# EAGLE design p2mini-001 (EAGLE 7.1.0)
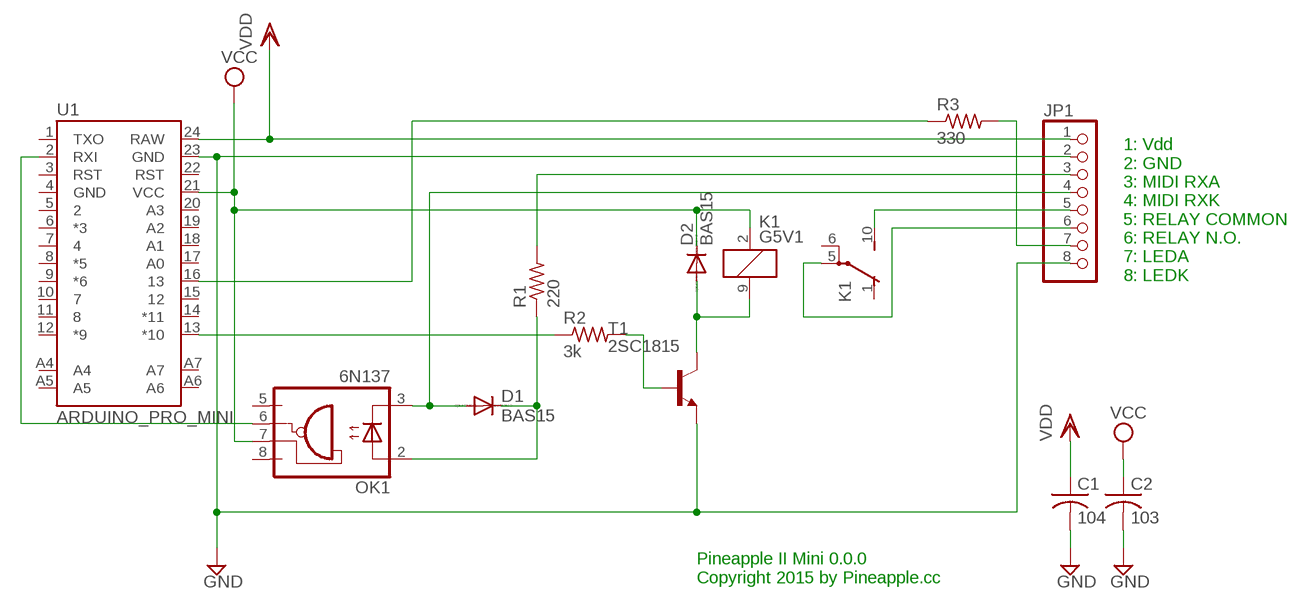
[diagram p0: schematic, sheet 1]

## Parts
C1  104  C-US025-025X050  [C025-025X050]
C2  103  C-US025-025X050  [C025-025X050]
D1  BAS15  [DO34-7]
D2  BAS15  [DO34-7]
JP1  PINHD-1X8  [1X08]
K1  G5V1  [G5V1]
OK1  6N137  [DIL08]
R1  220  R-US_0204/5  [0204/5]
R2  3k  R-US_0204/5  [0204/5]
R3  330  R-US_0204/5  [0204/5]
T1  2SC1815  [TO92-ECB]
U1  ARDUINO_PRO_MINI  [ARDUINO_PRO_MINI]

## Nets
GND: C1.2 C2.2 JP1.2 JP1.8 T1.E U1.23(GND)
MIDI0: JP1.3 R1.2
MIDI1: D1.A JP1.4 OK1.3(C)
N$1: JP1.5 K1.10(2:S)
N$2: D2.A K1.9 T1.C
N$3: R2.1 U1.13(*10)
N$4: R2.2 T1.B
N$5: JP1.6 K1.5(2:P)
N$6: R3.1 U1.16
N$8: JP1.7 R3.2
N$13: D1.C OK1.2(A) R1.1
RX: OK1.6(VO) U1.2(RXI)
VCC: C2.1 D2.C K1.2 OK1.7(VE) U1.21(VCC)
VDD: C1.1 JP1.1 U1.24(RAW)
Unconnected: K1.1(2:O) K1.6(2:P) OK1.5(GND) OK1.8(VCC) U1.1(TXO) U1.3(RST) U1.4(GND) U1.5 U1.6(*3) U1.7 U1.8(*5) U1.9(*6) U1.10 U1.11 U1.12(*9) U1.14(*11) U1.15 U1.17(A0) U1.18(A1) U1.19(A2) U1.20(A3) U1.22(RST) U1.A4 U1.A5 U1.A6 U1.A7

## Notes on the sheet
- 1: Vdd
  2: GND
  3: MIDI RXA
  4: MIDI RXK
  5: RELAY COMMON
  6: RELAY N.O.
  7: LEDA
  8: LEDK
- Pineapple II Mini 0.0.0
  Copyright 2015 by Pineapple.cc

## Library data of the parts
C1 C2 = rcl:C-US: CAPACITOR, American symbol
D1 D2 = diode:BAS15: DIODE high speed
JP1 = pinhead:PINHD-1X8: PIN HEADER
K1 = relay:G5V1: RELAY 1 x switch, 0.5 A/125 V AC, 1 A/24 V DC , Omron; MPN: G5V-1-DC24; OC_FARNELL: 9949593; OC_NEWARK: 36M6377
OK1 = optocoupler:6N137: MOTOROLA OPTO COUPLER; MPN: 6N137; OC_FARNELL: 1328376; OC_NEWARK: 52M1895
R1-R3 = resistor:R-US_: RESISTOR, American symbol
T1 = transistor:2SC1815: NPN EPITAXIAL TRANSISTOR Source: TOSHIBA .. 2SC1815 1.pdf
U1 = SparkFun-Boards:ARDUINO_PRO_MINI

## Board
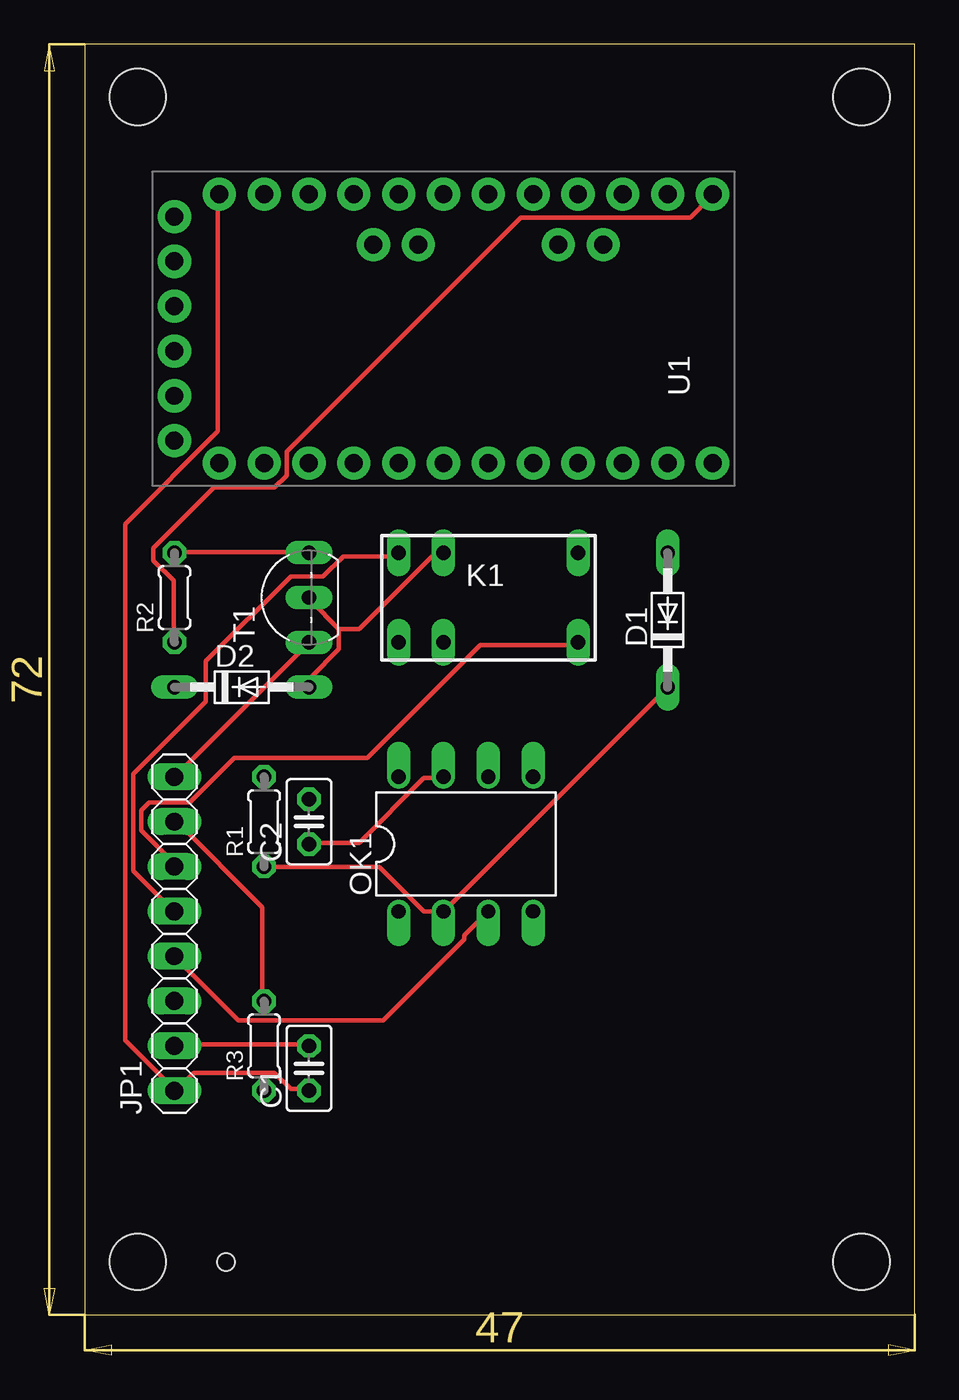
[diagram p1: board, top side]
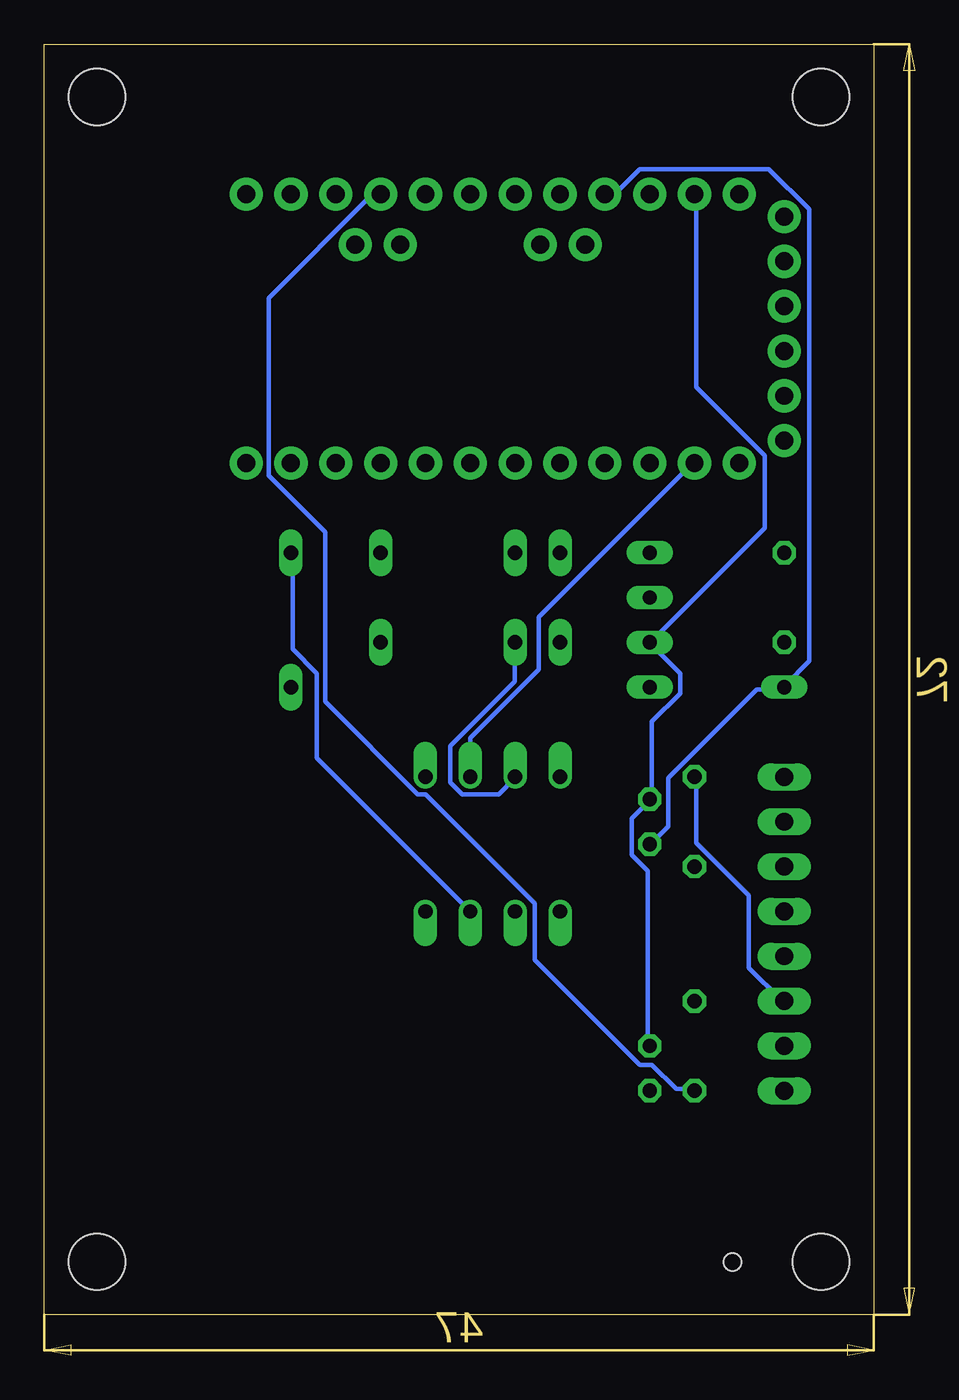
[diagram p2: board, bottom side, seen from below]

Size 47 x 72 mm. Coordinates in mm from the lower left corner, seen from the top.
Outline: 0,0 47,0 47,72 0,72 0,0
Copper layers (1*16): Top 0.035mm / dielectric 1.5mm / Bottom 0.035mm
Design rules "default": minimum track width 10mil, minimum drill 24mil, track to track 8mil, track to pad 8mil, pad to pad 8mil, via to via 8mil, smd to smd 8mil, copper to edge 40mil, drill to drill 8mil, minimum pad ring 10mil, minimum via ring 8mil, stop-mask expansion 4mil, vias tented up to drill 0mil, thermal gap 10mil
Holes 3.2 mm at 3,3 3,69 44,3 44,69
Holes 1 mm at 8,3

### Footprints (pad centres in the part's own frame; a part is rotated, then mirrored left to right if it is on the bottom)
C025-025X050 = drill 0.813 octagon: 1 -1.27,0; 2 1.27,0
DO34-7 = drill 0.813 long: A 3.81,0; C -3.81,0
1X08 = drill 1.016 long: 1 -8.89,0; 2 -6.35,0; 3 -3.81,0; 4 -1.27,0; 5 1.27,0; 6 3.81,0; 7 6.35,0; 8 8.89,0
G5V1 = drill 0.813 long: 1 -5.08,-2.54; 2 -2.54,-2.54; 5 5.08,-2.54; 6 5.08,2.54; 9 -2.54,2.54; 10 -5.08,2.54
DIL08 = drill 0.813 offset: 1 -3.81,-3.81; 2 -1.27,-3.81; 3 1.27,-3.81; 4 3.81,-3.81; 5 3.81,3.81; 6 1.27,3.81; 7 -1.27,3.81; 8 -3.81,3.81
0204/5 = drill 0.813 octagon: 1 -2.54,0; 2 2.54,0
TO92-ECB = drill 0.813 long: B 2.54,0; C 0,0; E -2.54,0
ARDUINO_PRO_MINI = drill 1.016 pad 1.88: 1 -7.62,12.7; 2 -7.62,10.16; 3 -7.62,7.62; 4 -7.62,5.08; 5 -7.62,2.54; 6 -7.62,0; 7 -7.62,-2.54; 8 -7.62,-5.08; 9 -7.62,-7.62; 10 -7.62,-10.16; 11 -7.62,-12.7; 12 -7.62,-15.24; 13 7.62,-15.24; 14 7.62,-12.7; 15 7.62,-10.16; 16 7.62,-7.62; 17 7.62,-5.08; 18 7.62,-2.54; 19 7.62,0; 20 7.62,2.54; 21 7.62,5.08; 22 7.62,7.62; 23 7.62,10.16; 24 7.62,12.7; A4 4.763,1.429; A5 4.763,3.969; A6 4.763,-9.049; A7 4.763,-6.509; BLK -6.35,15.24; GND -3.81,15.24; GRN 6.35,15.24; RXI 1.27,15.24; TXO 3.81,15.24; VCC -1.27,15.24

### Placement (x,y rotation side)
C1  12.7,13.97 90 top
C2  12.7,27.94 90 top
D1  33.02,39.37 90 top
D2  8.89,35.56 0 top
JP1  5.08,21.59 90 top
K1  22.86,40.64 0 top
OK1  21.59,26.67 0 top
R1  10.16,27.94 90 top
R2  5.08,40.64 90 top
R3  10.16,15.24 90 top
T1  12.7,40.64 90 top
U1  20.32,55.88 90 top

### Tracks (layer width: path | path; a pad name or v marks a point on that pad's centre or on a via)
GND
  Top 0.254: C1.2 12.57,15.32 5.26,15.32 JP1.2 | JP1.8 5.26,30.63 12.57,37.95 T1.E
  Bottom 0.254: U1.23 10.06,63.32 10.06,52.58 6.17,48.69 6.17,44.58 12.57,38.18 T1.E 12.57,37.95 10.97,36.35 10.97,35.2 12.57,33.6 12.57,29.26 C2.2 12.8,29.03 13.72,28.12 13.72,26.06 12.8,25.15 12.8,15.32 C1.2
MIDI0
  Bottom 0.254: R1.2 10.06,30.4 10.06,26.75 7.09,23.77 7.09,19.66 5.26,17.83 JP1.3
MIDI1
  Top 0.254: OK1.3 21.49,21.49 21.49,21.26 16.92,16.69 8.69,16.69 5.26,20.12 JP1.4
  Bottom 0.254: OK1.3 31.55,31.55 31.55,36.35 32.92,37.72 32.92,42.98 D1.A
N$1
  Top 0.254: K1.10 17.6,42.98 14.63,42.98 13.49,41.83 11.66,41.83 6.86,37.03 6.86,34.75 2.74,30.63 2.74,25.15 5.03,22.86 JP1.5
N$2
  Top 0.254: 14.4,38.86 14.4,37.72 12.8,36.12 12.8,35.66 D2.A | 14.4,38.86 12.8,40.46 T1.C | 14.4,38.86 15.54,38.86 19.66,42.98 20.12,42.98 K1.9
N$3
  Top 0.254: R2.1 5.03,38.18 5.03,41.6 3.89,42.75 3.89,43.43 7.32,46.86 10.74,46.86 11.43,47.55 11.43,48.92 24.69,62.18 34.29,62.18 35.43,63.32 U1.13
N$4
  Top 0.254: R2.2 5.26,43.2 12.57,43.2 T1.B
N$5
  Top 0.254: K1.5 27.89,37.95 22.4,37.95 16,31.55 8.46,31.55 5.94,29.03 3.66,29.03 3.2,28.57 3.2,27.43 5.03,25.6 JP1.6
N$6
  Bottom 0.254: R3.1 10.29,12.8 11.2,12.8 12.57,14.17 13.26,14.17 19.2,20.12 19.2,23.32 25.38,29.49 25.83,29.49 31.09,34.75 31.09,44.35 34.29,47.55 34.29,57.61 28.57,63.32 28.12,63.32 U1.16
N$8
  Top 0.254: R3.2 10.06,17.83 10.06,23.09 5.26,27.89 JP1.7
N$13
  Top 0.254: R1.1 10.29,25.38 16.69,25.38 19.2,22.86 OK1.2 20.34,22.86 32.92,35.43 D1.C
RX
  Bottom 0.254: OK1.6 22.86,32.69 18.97,36.58 18.97,39.55 10.29,48.23 U1.2
VCC
  Top 0.254: OK1.7 20.12,30.4 19.2,30.4 15.54,26.75 12.8,26.75 C2.1
  Bottom 0.254: C2.1 12.57,26.75 11.66,27.66 11.66,30.4 6.63,35.43 5.26,35.43 D2.C 5.03,35.66 3.66,37.03 3.66,62.64 5.94,64.92 13.26,64.92 14.63,63.55 15.09,63.55 U1.21 | K1.2 20.34,37.95 20.34,35.89 24,32.23 24,30.18 23.32,29.49 21.26,29.49 20.34,30.4 OK1.7
VDD
  Top 0.254: C1.1 12.57,12.8 11.66,12.8 10.74,13.72 6.17,13.72 5.26,12.8 JP1.1 5.03,12.8 2.29,15.54 2.29,44.81 7.54,50.06 7.54,63.32 U1.24

### Text on the board
Document: P2MINI 1.0.0